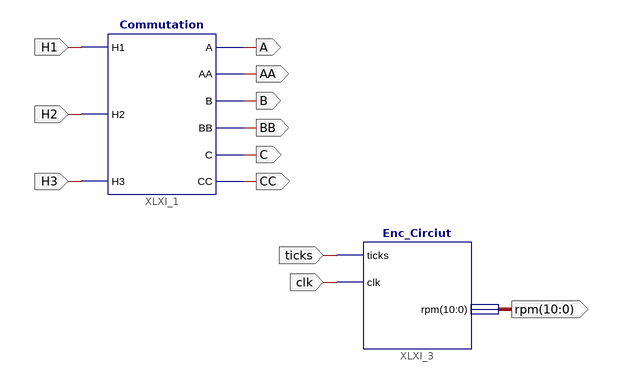
[diagram p0: schematic sheet 1]
// Xilinx ISE schematic MAIN_SCHEMATIC.sch (spartan3e) as structural Verilog: 2 symbols, 12 ports
module MAIN_SCHEMATIC (
  input  ticks,
  input  clk,
  input  H3,
  input  H2,
  input  H1,
  output A,
  output AA,
  output B,
  output BB,
  output C,
  output CC,
  output [10:0] rpm
);

  Commutation XLXI_1 (.H1(H1), .H2(H2), .H3(H3), .C(C), .BB(BB), .B(B), .AA(AA), .A(A), .CC(CC));
  Enc_Circiut XLXI_3 (.ticks(ticks), .clk(clk), .rpm(rpm));
endmodule
